# Altium schematic sheet Sheet1.SchDoc
size A2; SheetNumber: 1; SheetTotal: 1
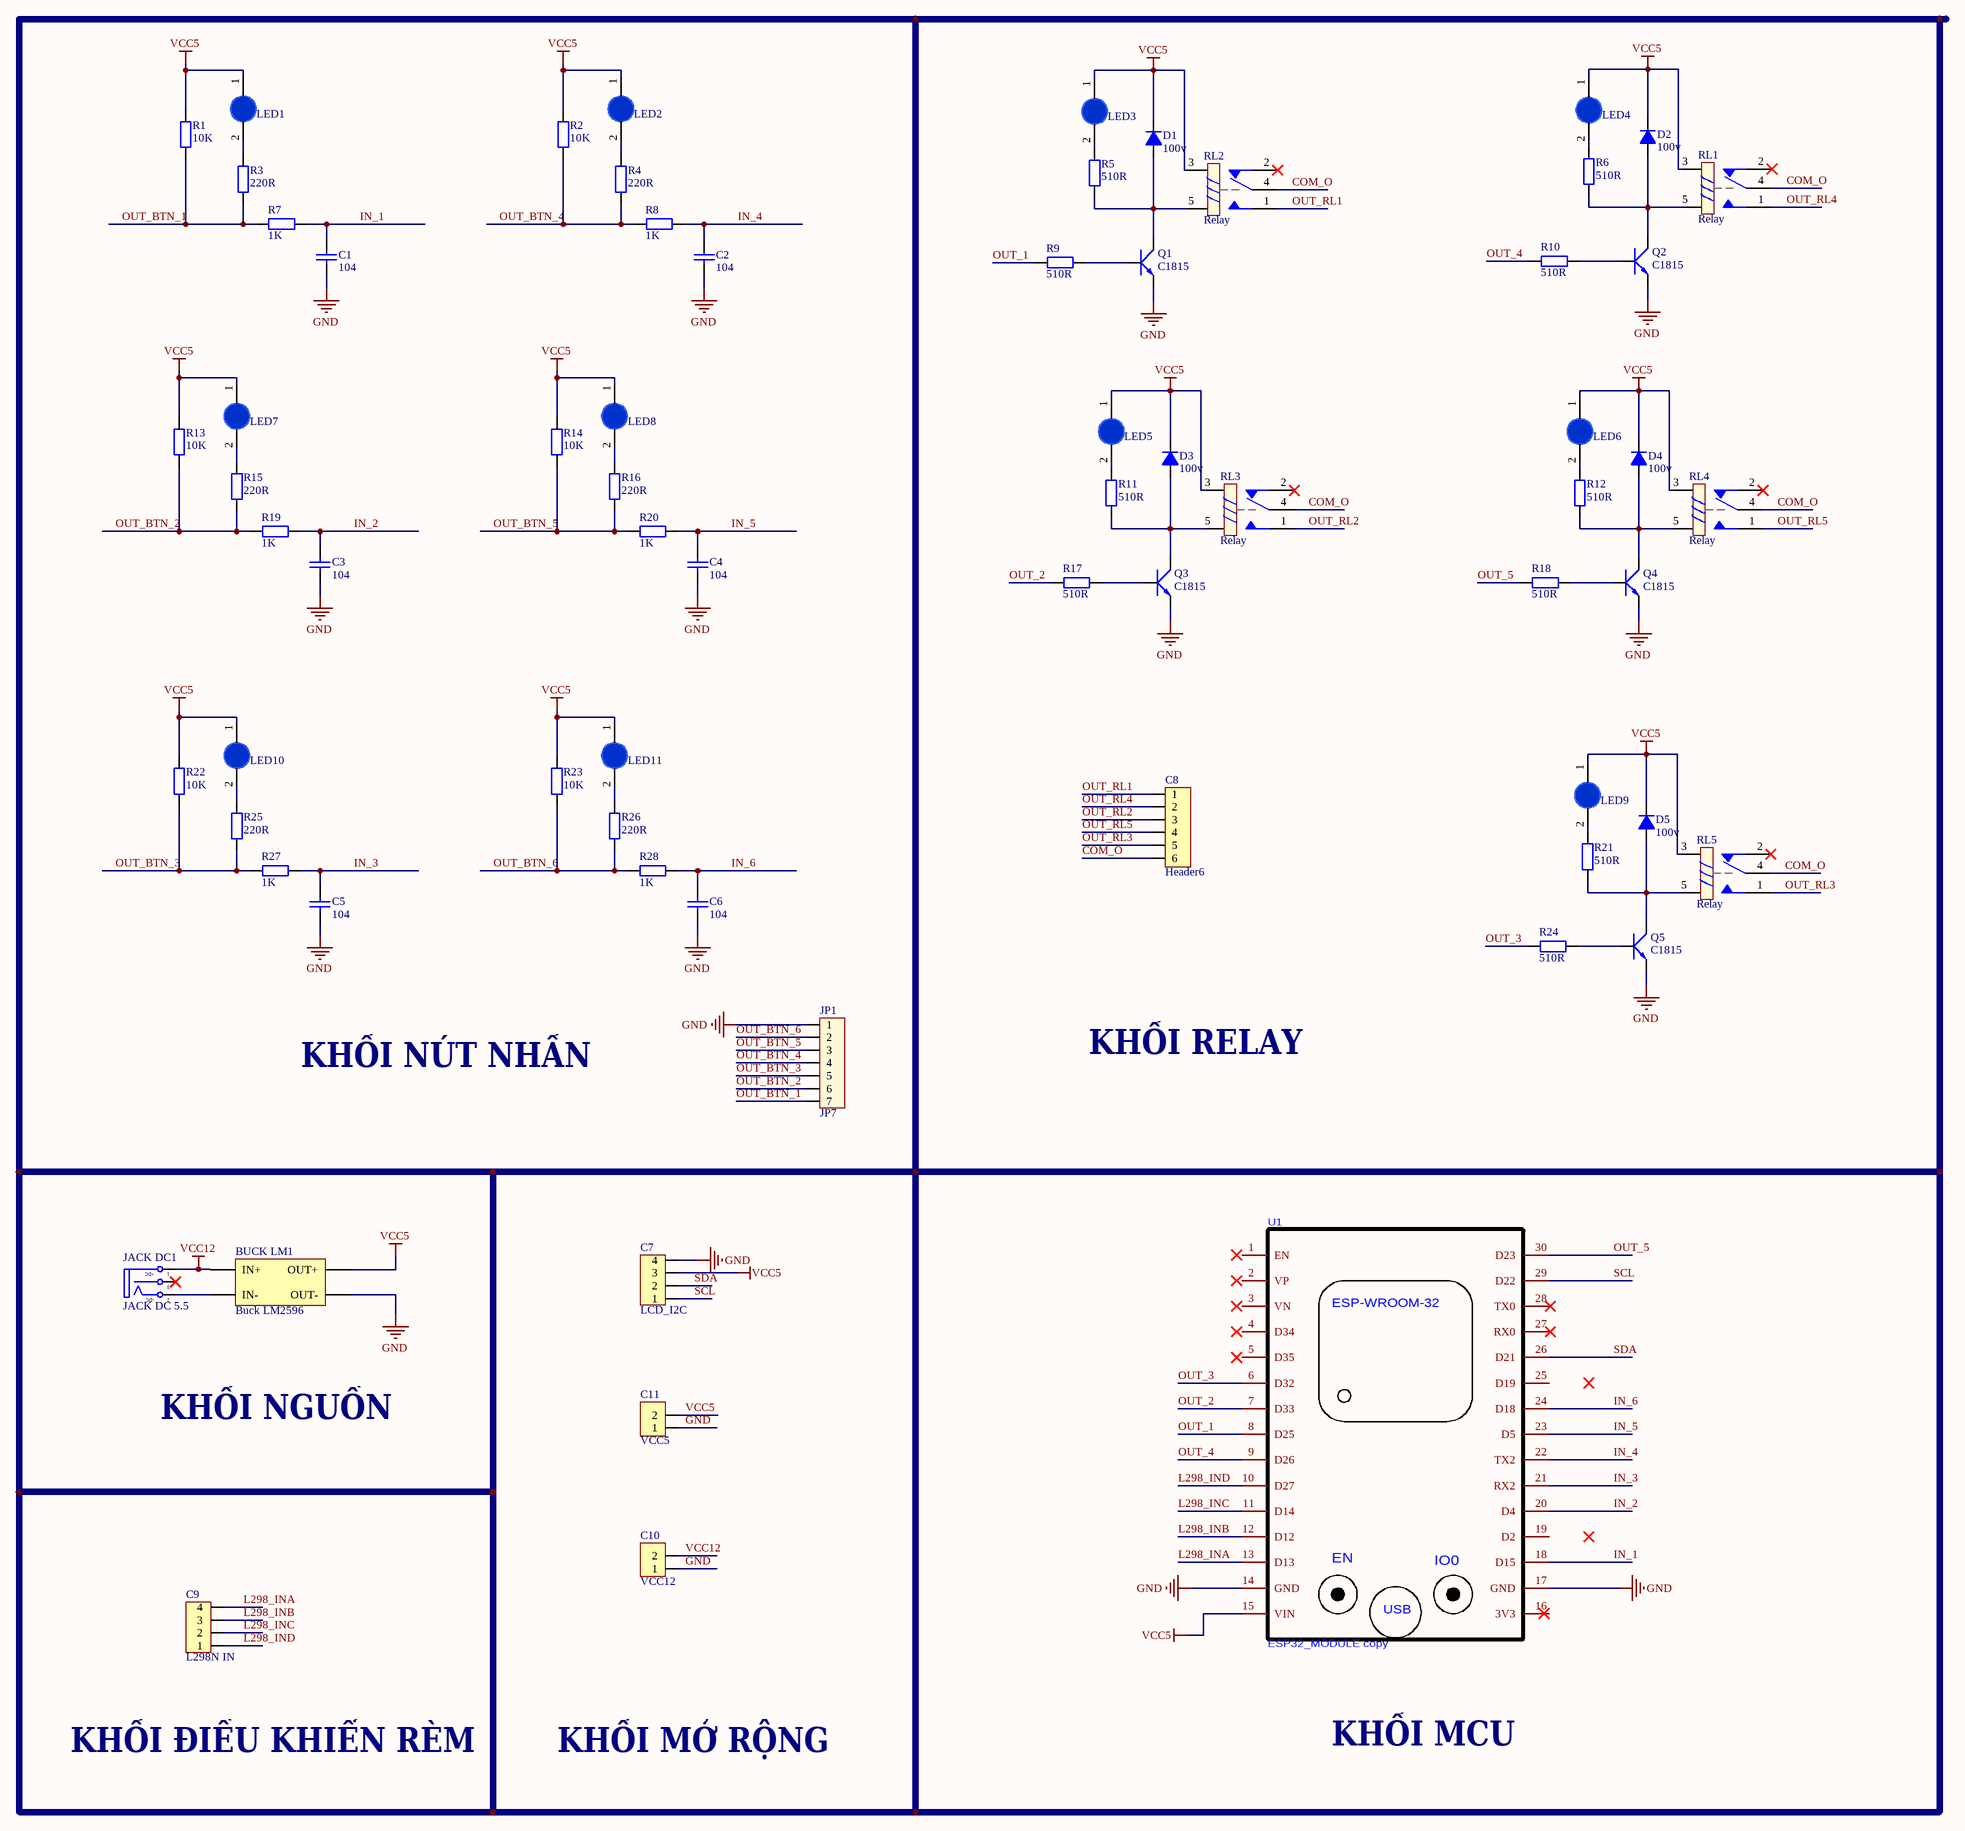
[diagram p0: Sheet1.SchDoc]

## Parts
BUCK_LM1  Buck LM2596  [BUCK LM2596]
C1  104  [tu gom]
C2  104  [tu gom]
C3  104  [tu gom]
C4  104  [tu gom]
C5  104  [tu gom]
C6  104  [tu gom]
C7  LCD_I2C  [Header4]
C8  Header6  [Header6]
C9  L298N IN  [Header4]
C10  VCC12  [Header2]
C11  VCC5  [Header2]
D1  100v  [DIODE 0.5A]
D2  100v  [DIODE 0.5A]
D3  100v  [DIODE 0.5A]
D4  100v  [DIODE 0.5A]
D5  100v  [DIODE 0.5A]
JACK_DC1  JACK DC 5.5  [JACK DC 5.5]
JP1  JP7  [Header7]
LED1  LED 3mm  [LED-3MM-BLUE]  (value not drawn)
LED2  LED 3mm  [LED-3MM-BLUE]  (value not drawn)
LED3  LED 3mm  [LED-3MM-BLUE]  (value not drawn)
LED4  LED 3mm  [LED-3MM-BLUE]  (value not drawn)
LED5  LED 3mm  [LED-3MM-BLUE]  (value not drawn)
LED6  LED 3mm  [LED-3MM-BLUE]  (value not drawn)
LED7  LED 3mm  [LED-3MM-BLUE]  (value not drawn)
LED8  LED 3mm  [LED-3MM-BLUE]  (value not drawn)
LED9  LED 3mm  [LED-3MM-BLUE]  (value not drawn)
LED10  LED 3mm  [LED-3MM-BLUE]  (value not drawn)
LED11  LED 3mm  [LED-3MM-BLUE]  (value not drawn)
Q1  C1815  [C1815_cam]
Q2  C1815  [C1815_cam]
Q3  C1815  [C1815_cam]
Q4  C1815  [C1815_cam]
Q5  C1815  [C1815_cam]
R1  10K  [R1/4W]
R2  10K  [R1/4W]
R3  220R  [R1/4W]
R4  220R  [R1/4W]
R5  510R  [R1/4W]
R6  510R  [R1/4W]
R7  1K  [R1/4W]
R8  1K  [R1/4W]
R9  510R  [R1/4W]
R10  510R  [R1/4W]
R11  510R  [R1/4W]
R12  510R  [R1/4W]
R13  10K  [R1/4W]
R14  10K  [R1/4W]
R15  220R  [R1/4W]
R16  220R  [R1/4W]
R17  510R  [R1/4W]
R18  510R  [R1/4W]
R19  1K  [R1/4W]
R20  1K  [R1/4W]
R21  510R  [R1/4W]
R22  10K  [R1/4W]
R23  10K  [R1/4W]
R24  510R  [R1/4W]
R25  220R  [R1/4W]
R26  220R  [R1/4W]
R27  1K  [R1/4W]
R28  1K  [R1/4W]
RL1  Relay  [RELAY_SRA_05VDC_SL_C]
RL2  Relay  [RELAY_SRA_05VDC_SL_C]
RL3  Relay  [RELAY_SRA_05VDC_SL_C]
RL4  Relay  [RELAY_SRA_05VDC_SL_C]
RL5  Relay  [RELAY_SRA_05VDC_SL_C]
U1  ESP32_MODULE copy  [ESP32-WIFIMODULE-FOOTPRINT]

## Nets
GND: BUCK_LM1.3(OUT-) C1.2 C2.2 C3.2 C4.2 C5.2 C6.2 C7.4 C10.1 C11.1 JP1.1 Q1.1(E) Q2.1(E) Q3.1(E) Q4.1(E) Q5.1(E) U1.14(GND) U1.17(GND)
VCC5: BUCK_LM1.4(OUT+) C7.3 C11.2 D1.2(K) D2.2(K) D3.2(K) D4.2(K) D5.2(K) LED1.1(A) LED2.1(A) LED3.1(A) LED4.1(A) LED5.1(A) LED6.1(A) LED7.1(A) LED8.1(A) LED9.1(A) LED10.1(A) LED11.1(A) R1.2 R2.2 R13.2 R14.2 R22.2 R23.2 RL1.3 RL2.3 RL3.3 RL4.3 RL5.3 U1.15(VIN)
VCC12: BUCK_LM1.1(IN+) C10.2 JACK_DC1.1(T)
COM_O: C8.6 RL1.4 RL2.4 RL3.4 RL4.4 RL5.4
IN_1: C1.1 R7.1 U1.18(D15)
IN_2: C3.1 R19.1 U1.20(D4)
IN_3: C5.1 R27.1 U1.21(RX2)
IN_4: C2.1 R8.1 U1.22(TX2)
IN_5: C4.1 R20.1 U1.23(D5)
IN_6: C6.1 R28.1 U1.24(D18)
L298_INA: C9.4 U1.13(D13)
L298_INB: C9.3 U1.12(D12)
L298_INC: C9.2 U1.11(D14)
L298_IND: C9.1 U1.10(D27)
OUT_1: R9.1 U1.8(D25)
OUT_2: R17.1 U1.7(D33)
OUT_3: R24.1 U1.6(D32)
OUT_4: R10.1 U1.9(D26)
OUT_5: R18.1 U1.30(D23)
OUT_BTN_1: JP1.7 R1.1 R3.1 R7.2
OUT_BTN_2: JP1.6 R13.1 R15.1 R19.2
OUT_BTN_3: JP1.5 R22.1 R25.1 R27.2
OUT_BTN_4: JP1.4 R2.1 R4.1 R8.2
OUT_BTN_5: JP1.3 R14.1 R16.1 R20.2
OUT_BTN_6: JP1.2 R23.1 R26.1 R28.2
OUT_RL1: C8.1 RL2.1
OUT_RL2: C8.3 RL3.1
OUT_RL3: C8.5 RL5.1
OUT_RL4: C8.2 RL1.1
OUT_RL5: C8.4 RL4.1
SCL: C7.1 U1.29(D22)
SDA: C7.2 U1.26(D21)
NetBUCK_LM1_2: BUCK_LM1.2(IN-) JACK_DC1.2(TN)
NetD1_1: D1.1(A) Q1.2(C) R5.2 RL2.5
NetD2_1: D2.1(A) Q2.2(C) R6.2 RL1.5
NetD3_1: D3.1(A) Q3.2(C) R11.2 RL3.5
NetD4_1: D4.1(A) Q4.2(C) R12.2 RL4.5
NetD5_1: D5.1(A) Q5.2(C) R21.2 RL5.5
NetLED1_2: LED1.2(K) R3.2
NetLED2_2: LED2.2(K) R4.2
NetLED3_2: LED3.2(K) R5.1
NetLED4_2: LED4.2(K) R6.1
NetLED5_2: LED5.2(K) R11.1
NetLED6_2: LED6.2(K) R12.1
NetLED7_2: LED7.2(K) R15.2
NetLED8_2: LED8.2(K) R16.2
NetLED9_2: LED9.2(K) R21.1
NetLED10_2: LED10.2(K) R25.2
NetLED11_2: LED11.2(K) R26.2
NetQ1_3: Q1.3(B) R9.2
NetQ2_3: Q2.3(B) R10.2
NetQ3_3: Q3.3(B) R17.2
NetQ4_3: Q4.3(B) R18.2
NetQ5_3: Q5.3(B) R24.2

Not connected (* = marked no-connect by the designer): JACK_DC1 3(S)*; RL1 2*; RL2 2*; RL3 2*; RL4 2*; RL5 2*; U1 1(EN) 2(VP) 3(VN) 4(D34) 5(D35) 16(3V3) 19(D2) 25(D19) 27(RX0) 28(TX0)

## Notes on the sheet
- KHỐI NÚT NHẤN
- KHỐI RELAY
- KHỐI NGUỒN
- KHỐI ĐIỀU KHIỂN RÈM
- KHỐI MỞ RỘNG
- KHỐI MCU
- (in symbol ESP32_MODULE copy) ESP-WROOM-32; IO0; USB
- (in symbol JACK DC 5.5) +DC; -DC

## Library data of the parts
C1-C6 = Tu gom 104 50V: Cắm; So_Chan: 2; Ten_Linh_Kien: Tụ gốm 104 100nF 50V; Don_Vi: Con; Ma_Hang: MH004761; Chung_Loai: Cắm; Kieu_Chan: *
C7 C9 = Header4: Header IDC, 4 x 1 Pin Vertical 2.54mm Pitch (Non-Boxed, Male); Manufacturer: W¨¹rth Elektronik eiSos GmbH; partNo: 613002143121; ComponentLink1 Description: Manufacturer; ComponentLink2 Description: Datasheet; NoPins: 02; Created Date: 29 March 2013; ComponentLink1URL: http://www.we-online.com; ComponentLink2URL: http://katalog.we-online.de/em/datasheet/6130xx143121.pdf; Created by: Karrer Zheng
C8 = Header6: Header IDC, 6 x 1 Pin Vertical 2.54mm Pitch (Non-Boxed, Male); Manufacturer: W¨¹rth Elektronik eiSos GmbH; partNo: 613002143121; ComponentLink1 Description: Manufacturer; ComponentLink2 Description: Datasheet; NoPins: 02; Created Date: 29 March 2013; ComponentLink1URL: http://www.we-online.com; ComponentLink2URL: http://katalog.we-online.de/em/datasheet/6130xx143121.pdf; Created by: Karrer Zheng
C10 C11 = Header2: Header IDC, 2 x 1 Pin Vertical 2.54mm Pitch (Non-Boxed, Male); Manufacturer: W¨¹rth Elektronik eiSos GmbH; partNo: 613002143121; ComponentLink1 Description: Manufacturer; ComponentLink2 Description: Datasheet; NoPins: 02; Created Date: 29 March 2013; ComponentLink1URL: http://www.we-online.com; ComponentLink2URL: http://katalog.we-online.de/em/datasheet/6130xx143121.pdf; Created by: Karrer Zheng
D1-D5 = Diode 1N4148: Cắm; Ten_Linh_Kien: Diode 1N4148 DO35 450mA 100V ( 1N4148 DIP); Don_Vi: Con; Ma_Hang: MH001065; Ghi Chu: *; Kieu_Chan: *; Chung_Loai: Cắm
JACK_DC1 = JACK DC 5.5: Value: Jac DC
JP1 = Header7: Connector 7; Value: Connector 7
LED1-LED11 = LED 3mm Xanh Duong: Cắm; Don_Vi: Con; Ma_Hang: MH009003; Ten_Linh_Kien: LED 3MM Xanh Dương SS (1000c); Ghi_Chu: *; Kieu_Chan: *; Chung_Loai: Cắm
Q1-Q5 = C1815: NPN 600mW, ECB; Value: C1815
R1-R28 = R1/4W: Resistor 1/4W; Value: R1/4W - 1K
RL1-RL5 = RL_SRA-05VDC-SL-C: Relay 5 Chan; Ma_Hang: MH009374; Ten: Relay 5V10A SRD-05VDC-SL-C Chính Hãng